# EAGLE design gpib-usbcdc (EAGLE 4.16)
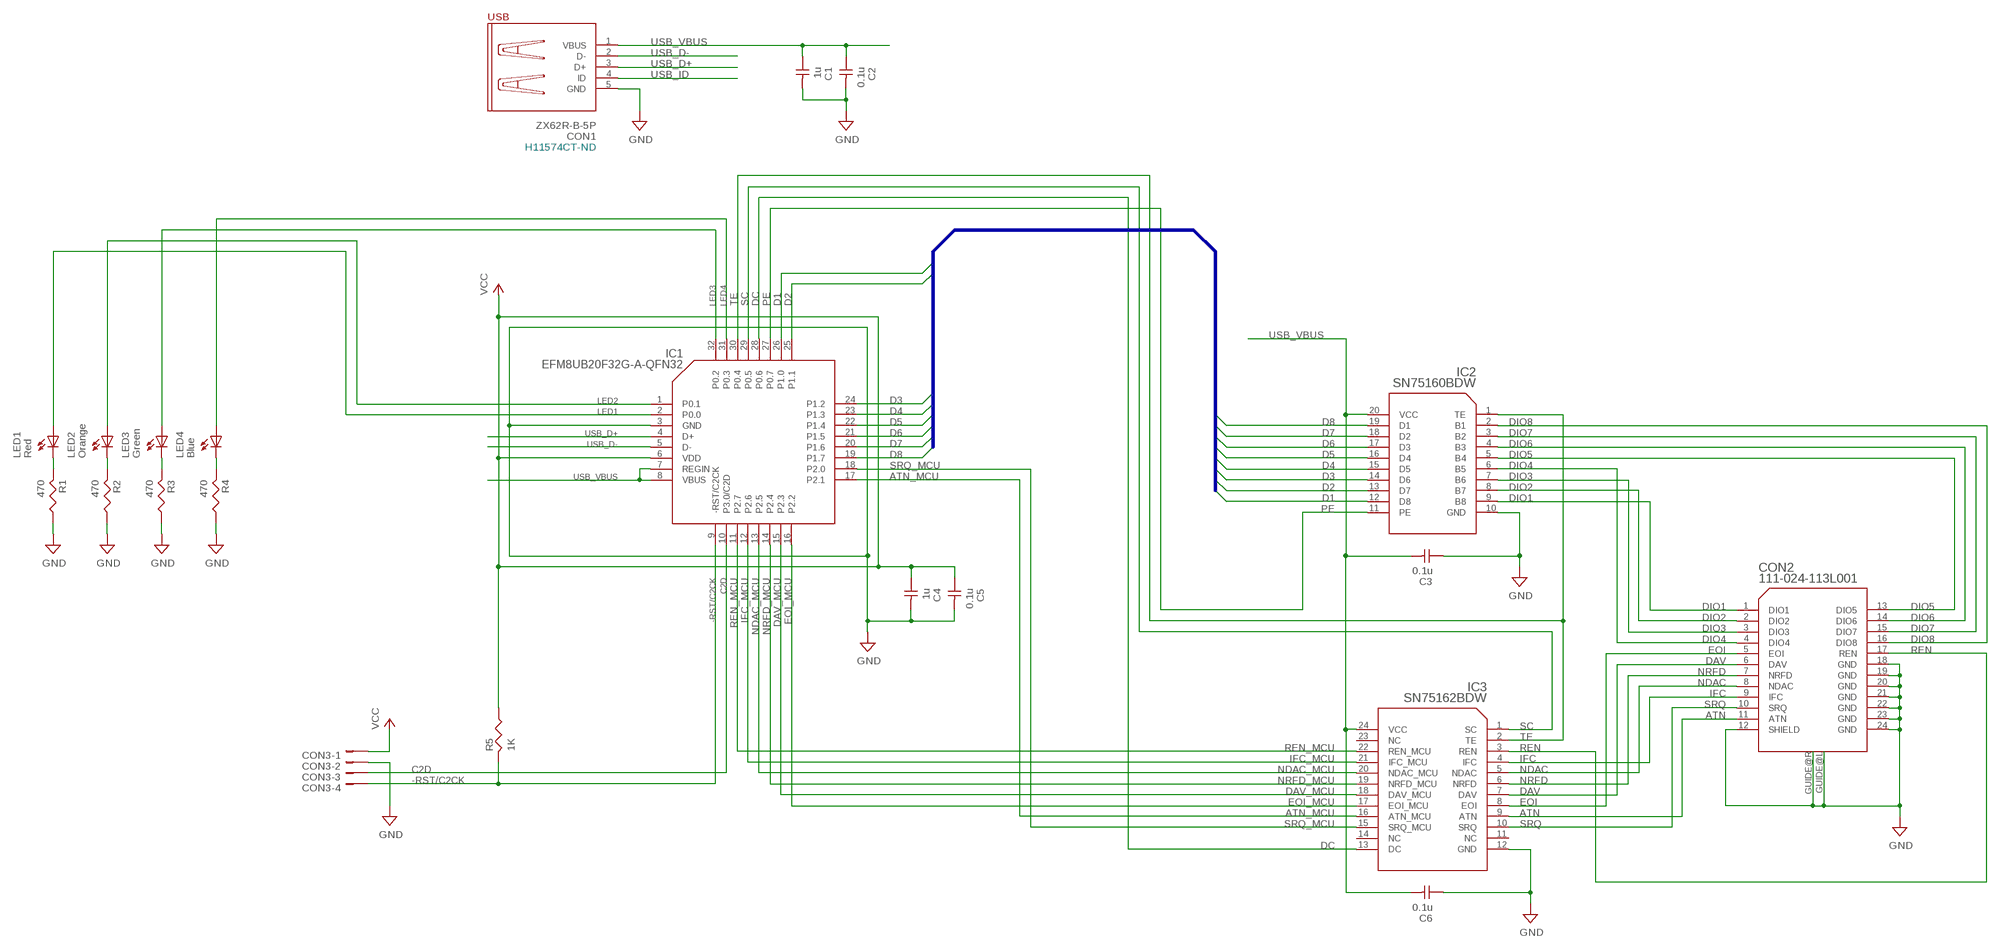
[diagram p0: schematic, sheet 1]

## Parts
C1  1u  C1005  [1005]
C2  0.1u  C1005  [1005]
C3  0.1u  C1005  [1005]
C4  1u  C1005  [1005]
C5  0.1u  C1005  [1005]
C6  0.1u  C1005  [1005]
CON1  ZX62R-B-5P  ZX62-AB-5PA-R-2PAD  [ZX62R-AB-5PA(-2PAD)]
CON2  111-024-113L001  [111-024-113L001]
CON3  JST_ZH-4B  [JST_ZH-4B]
IC1  EFM8UB20F32G-A-QFN32  C8051F341_32-GM  [QFN32]
IC2  SN75160BDW  SN75ALS160DW  [SO20]
IC3  SN75162BDW  SN75ALS162DW  [SO24]
LED1  Red  LED1608  [1608D]
LED2  Orange  LED1608  [1608D]
LED3  Green  LED1608  [1608D]
LED4  Blue  LED1608  [1608D]
R1  470  R1005  [1005]
R2  470  R1005  [1005]
R3  470  R1005  [1005]
R4  470  R1005  [1005]
R5  1K  R1005  [1005]

## Nets
-RST/C2CK: CON3.4 IC1.9(-RST/C2CK) R5.P$2
ATN: CON2.11(ATN) IC3.9(ATN)
ATN_MCU: IC1.17(P2.1) IC3.16(ATN_MCU)
C2D: CON3.3 IC1.10(P3.0/C2D)
D1: IC1.26(P1.0) IC2.12(D8)
D2: IC1.25(P1.1) IC2.13(D7)
D3: IC1.24(P1.2) IC2.14(D6)
D4: IC1.23(P1.3) IC2.15(D5)
D5: IC1.22(P1.4) IC2.16(D4)
D6: IC1.21(P1.5) IC2.17(D3)
D7: IC1.20(P1.6) IC2.18(D2)
D8: IC1.19(P1.7) IC2.19(D1)
DAV: CON2.6(DAV) IC3.7(DAV)
DAV_MCU: IC1.15(P2.3) IC3.18(DAV_MCU)
DC: IC1.28(P0.6) IC3.13(DC)
DIO1: CON2.1(DIO1) IC2.9(B8)
DIO2: CON2.2(DIO2) IC2.8(B7)
DIO3: CON2.3(DIO3) IC2.7(B6)
DIO4: CON2.4(DIO4) IC2.6(B5)
DIO5: CON2.13(DIO5) IC2.5(B4)
DIO6: CON2.14(DIO6) IC2.4(B3)
DIO7: CON2.15(DIO7) IC2.3(B2)
DIO8: CON2.16(DIO8) IC2.2(B1)
EOI: CON2.5(EOI) IC3.8(EOI)
EOI_MCU: IC1.16(P2.2) IC3.17(EOI_MCU)
GND: C1.P$2 C2.P$2 C3.P$1 C4.P$2 C5.P$2 C6.P$1 CON1.5(GND) CON2.12(SHIELD) CON2.18(GND) CON2.19(GND) CON2.20(GND) CON2.21(GND) CON2.22(GND) CON2.23(GND) CON2.24(GND) CON2.GUIDE@L CON2.GUIDE@R CON3.2 IC1.3(GND) IC2.10(GND) IC3.12(GND) R1.P$1 R2.P$1 R3.P$1 R4.P$1
IFC: CON2.9(IFC) IC3.4(IFC)
IFC_MCU: IC1.12(P2.6) IC3.21(IFC_MCU)
LED1: IC1.2(P0.0) LED1.A
LED2: IC1.1(P0.1) LED2.A
LED3: IC1.32(P0.2) LED3.A
LED4: IC1.31(P0.3) LED4.A
N$1: LED1.K R1.P$2
N$2: LED3.K R3.P$2
N$6: LED2.K R2.P$2
N$20: LED4.K R4.P$2
NDAC: CON2.8(NDAC) IC3.5(NDAC)
NDAC_MCU: IC1.13(P2.5) IC3.20(NDAC_MCU)
NRFD: CON2.7(NRFD) IC3.6(NRFD)
NRFD_MCU: IC1.14(P2.4) IC3.19(NRFD_MCU)
PE: IC1.27(P0.7) IC2.11(PE)
REN: CON2.17(REN) IC3.3(REN)
REN_MCU: IC1.11(P2.7) IC3.22(REN_MCU)
SC: IC1.29(P0.5) IC3.1(SC)
SRQ: CON2.10(SRQ) IC3.10(SRQ)
SRQ_MCU: IC1.18(P2.0) IC3.15(SRQ_MCU)
TE: IC1.30(P0.4) IC2.1(TE) IC3.2(TE)
USB_D+: CON1.3(D+) IC1.4(D+)
USB_D-: CON1.2(D-) IC1.5(D-)
USB_ID: CON1.4(ID)
USB_VBUS: C1.P$1 C2.P$1 C3.P$2 C6.P$2 CON1.1(VBUS) IC1.7(REGIN) IC1.8(VBUS) IC2.20(VCC) IC3.24(VCC)
VCC: C4.P$1 C5.P$1 CON3.1 IC1.6(VDD) R5.P$1
Unconnected: IC3.11(NC) IC3.14(NC) IC3.23(NC)

## Buses
D[1..8]

## Notes on the sheet
- H11574CT-ND

## Power pins joined to a net without a drawn wire
GND: CON1.GUIDE@L1(GND) CON1.GUIDE@L3(GND) CON1.GUIDE@R1(GND) CON1.GUIDE@R3(GND)

## Library data of the parts
C1-C6 = additional:C: Capacitor (Non-Polar)
CON1 = additional:ZX62-AB-5PA: USB Micro-AB Connector
CON2 = gpib:111-024-113L001: NorComp 111-024-113L001 24pin connector for GPIB
CON3 = additional:JST_ZH-4*: JST_ZH-4 1.5mm pitch 4-pins Connector.
IC1 = main:C8051F34*_32: C8051F342/3/6/7 C8051F381/3/5/7 Full Speed USB Flash MCU 32 pins
IC2 = gpib:SN75ALS160: SN75ALS160 Octal general-purpose interface bus transceiver
IC3 = gpib:SN75ALS162: SN75ALS162 OCTAL GENERAL-PURPOSE INTERFACE BUS TRANSCEIVER
LED1-LED4 = additional:LED: Light Emitting Diode
R1-R5 = additional:R: Resistance

## Board
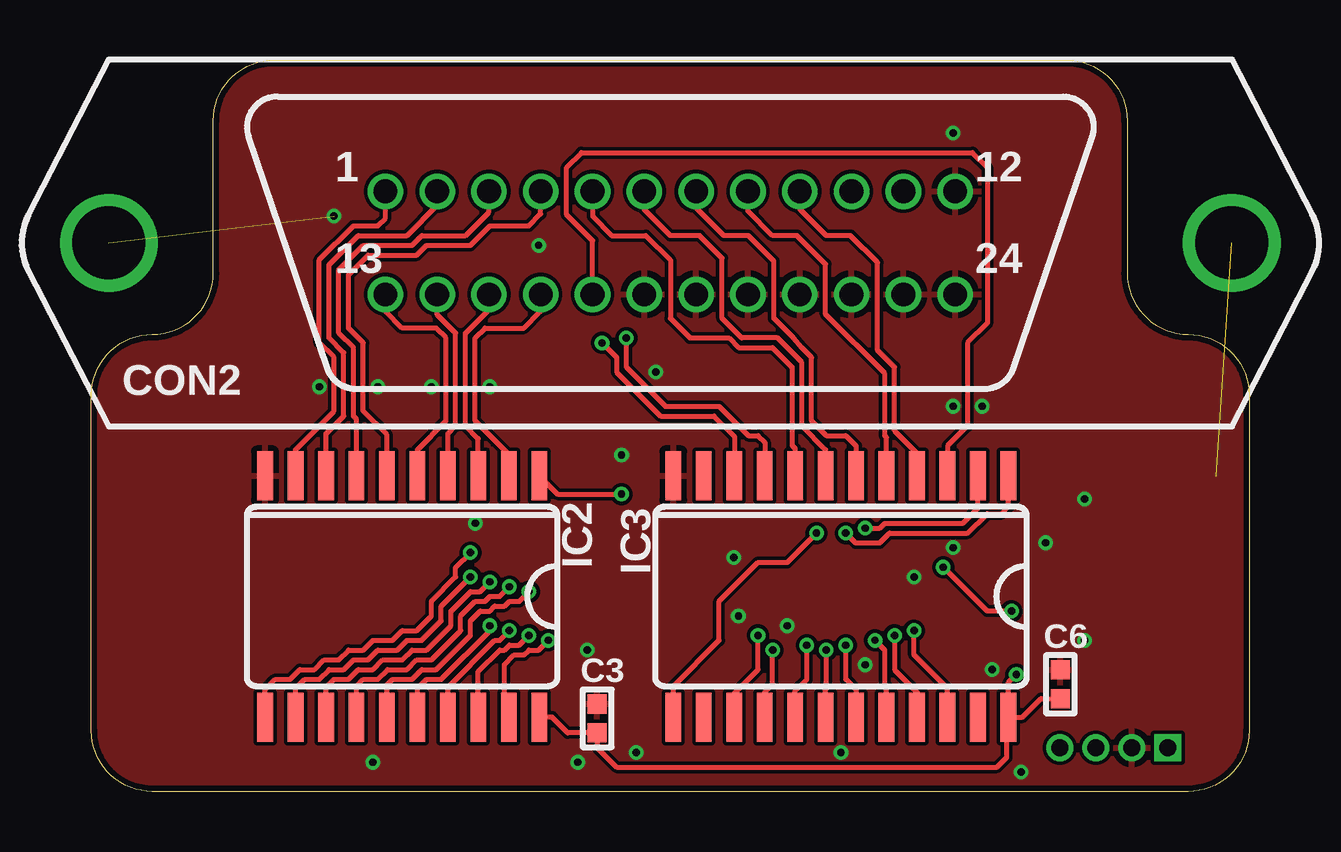
[diagram p1: board, top side]
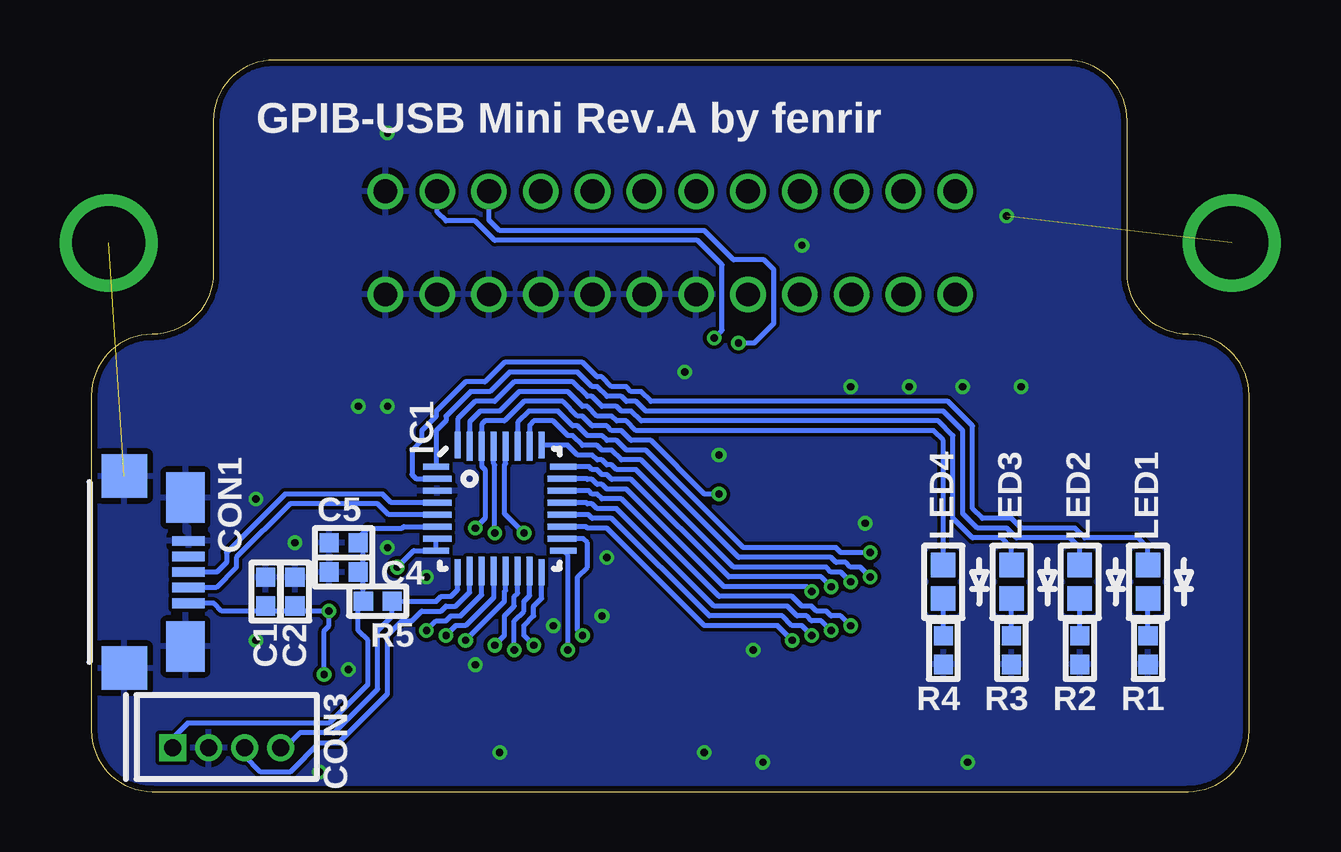
[diagram p2: board, bottom side, seen from below]

Size 48.26 x 30.48 mm. Coordinates in mm from the lower left corner, seen from the top.
Outline: 5.08,27.94 arc-90 7.62,30.48 40.64,30.48 arc-90 43.18,27.94 43.18,21.59 arc90 45.72,19.05 arc-90 48.26,16.51 48.26,2.54 arc-90 45.72,0 2.54,0 arc-90 0,2.54 0,16.51 arc-90 2.54,19.05 arc90 5.08,21.59 5.08,27.94
Copper layers (1*2*15*16): Top 0.035mm / dielectric 0.2mm / Route2 0.0175mm / dielectric 1.1mm / Route15 0.0175mm / dielectric 0.2mm / Bottom 0.035mm
Design rules "SeeedStudio_DRU_no_angle_20130527": minimum track width 6mil, minimum drill 12mil, track to track 6mil, track to pad 6mil, pad to pad 6mil, via to via 6mil, smd to smd 0mil, copper to edge 10mil, drill to drill 10mil, minimum pad ring 6mil, minimum via ring 6mil, stop-mask expansion 2mil, vias tented up to drill 25mil, thermal gap 10mil

### Footprints (pad centres in the part's own frame; a part is rotated, then mirrored left to right if it is on the bottom)
1005 = smd 0.8 x 0.8: P$1 -0.6,0; P$2 0.6,0
ZX62R-AB-5PA(-2PAD) = smd 0.4 x 1.35: 1 1.3,2.675; 2 0.65,2.675; 3 0,2.675; 4 -0.65,2.675; 5 -1.3,2.675 | smd 2.1 x 1.6: GUIDE@L1 -3.1,2.55; GUIDE@R1 3.1,2.55 | smd 1.8 x 1.9: GUIDE@L3 -4,0; GUIDE@R3 4,0
111-024-113L001 = drill 0.991 round: 1 -11.874,2.146; 2 -9.716,2.146; 3 -7.556,2.146; 4 -5.397,2.146; 5 -3.239,2.146; 6 -1.079,2.146; 7 1.079,2.146; 8 3.239,2.146; 9 5.397,2.146; 10 7.556,2.146; 11 9.716,2.146; 12 11.874,2.146; 13 -11.874,-2.146; 14 -9.716,-2.146; 15 -7.556,-2.146; 16 -5.397,-2.146; 17 -3.239,-2.146; 18 -1.079,-2.146; 19 1.079,-2.146; 20 3.239,-2.146; 21 5.397,-2.146; 22 7.556,-2.146; 23 9.716,-2.146; 24 11.874,-2.146 | drill 3.048 round: GUIDE@L -23.406,0; GUIDE@R 23.406,0
JST_ZH-4B = drill 0.711 pad 1.118 square: 1 -2.25,0 | drill 0.711 pad 1.118 round: 2 -0.75,0; 3 0.75,0; 4 2.25,0
QFN32 = smd 1.1 x 0.25: 1 -2.65,1.75; 8 -2.65,-1.75; 17 2.65,-1.75; 24 2.65,1.75 | smd 1.2 x 0.25: 2 -2.6,1.25; 3 -2.6,0.75; 4 -2.6,0.25; 5 -2.6,-0.25; 6 -2.6,-0.75; 7 -2.6,-1.25; 18 2.6,-1.25; 19 2.6,-0.75; 20 2.6,-0.25; 21 2.6,0.25; 22 2.6,0.75; 23 2.6,1.25 | smd 0.25 x 1.1: 9 -1.75,-2.65; 16 1.75,-2.65; 25 1.75,2.65; 32 -1.75,2.65 | smd 0.25 x 1.2: 10 -1.25,-2.6; 11 -0.75,-2.6; 12 -0.25,-2.6; 13 0.25,-2.6; 14 0.75,-2.6; 15 1.25,-2.6; 26 1.25,2.6; 27 0.75,2.6; 28 0.25,2.6; 29 -0.25,2.6; 30 -0.75,2.6; 31 -1.25,2.6
SO20 = smd 0.66 x 2.032: 1 -5.715,-5.029; 2 -4.445,-5.029; 3 -3.175,-5.029; 4 -1.905,-5.029; 5 -0.635,-5.029; 6 0.635,-5.029; 7 1.905,-5.029; 8 3.175,-5.029; 9 4.445,-5.029; 10 5.715,-5.029; 11 5.715,5.029; 12 4.445,5.029; 13 3.175,5.029; 14 1.905,5.029; 15 0.635,5.029; 16 -0.635,5.029; 17 -1.905,5.029; 18 -3.175,5.029; 19 -4.445,5.029; 20 -5.715,5.029
SO24 = smd 0.66 x 2.032: 1 -6.985,-5.029; 2 -5.715,-5.029; 3 -4.445,-5.029; 4 -3.175,-5.029; 5 -1.905,-5.029; 6 -0.635,-5.029; 7 0.635,-5.029; 8 1.905,-5.029; 9 3.175,-5.029; 10 4.445,-5.029; 11 5.715,-5.029; 12 6.985,-5.029; 13 6.985,5.029; 14 5.715,5.029; 15 4.445,5.029; 16 3.175,5.029; 17 1.905,5.029; 18 0.635,5.029; 19 -0.635,5.029; 20 -1.905,5.029; 21 -3.175,5.029; 22 -4.445,5.029; 23 -5.715,5.029; 24 -6.985,5.029
1608D = smd 1.016 x 1.016: A -0.7,0; K 0.7,0

### Placement (x,y rotation side)
C1  41,8.33 90 bottom
C2  39.78,8.33 90 bottom
C3  21.08,3.05 270 top
C4  37.74,9.14 180 bottom
C5  37.74,10.36 180 bottom
C6  40.39,4.47 270 top
CON1  46.89,9.14 270 bottom
CON2  24.13,22.86 0 top
CON3  42.62,1.83 0 bottom
IC1  31.24,11.79 0 bottom
IC2  12.95,8.13 180 top
IC3  31.24,8.13 180 top
LED1  4.22,8.74 270 bottom
LED2  7.06,8.74 270 bottom
LED3  9.91,8.74 270 bottom
LED4  12.75,8.74 270 bottom
R1  4.22,5.89 90 bottom
R2  7.06,5.89 90 bottom
R3  9.91,5.89 90 bottom
R4  12.75,5.89 90 bottom
R5  36.32,7.92 0 bottom

### Tracks (layer width: path | path; a pad name or v marks a point on that pad's centre or on a via)
-RST/C2CK
  Bottom 0.203: IC1.9 32.99,8.41 33.27,8.13 33.68,8.13 33.88,7.92 R5.P$2 35.72,7.31 36.32,6.71 36.32,4.27 38.15,2.44 39.57,2.44 40.18,1.83 CON3.4
ATN  (via drill 0.3)
  Top 0.203: IC3.9 28.07,14.55 27.79,14.83 27.38,14.83 26.16,16.05 23.93,16.05 22.3,17.68 v22.3,18.9
  Bottom 0.203: CON2.11 33.85,24.14 33.48,23.77 32.26,23.77 31.45,22.96 22.99,22.96 21.97,21.95 21.97,19.23 v22.3,18.9
ATN_MCU  (via drill 0.3)
  Top 0.203: IC3.16 28.07,4.14 28.4,4.47 v28.4,5.89
  Bottom 0.203: IC1.17 28.4,9.84 v28.4,5.89
C2D
  Bottom 0.203: IC1.10 32.49,8.3 33.07,7.72 33.48,7.72 33.68,7.52 34.49,7.52 34.9,7.11 35.31,7.11 35.92,6.5 35.92,4.06 37.95,2.03 38.76,2.03 39.98,0.81 41.2,0.81 41.87,1.49 CON3.3
D1  (via drill 0.3)
  Top 0.203: IC2.12 8.51,4.29 8.89,4.67 9.5,4.67 9.91,5.08 10.52,5.08 10.92,5.49 11.53,5.49 11.94,5.89 12.75,5.89 13.16,6.3 13.77,6.3 14.58,7.11 14.58,7.72 v15.8,8.94
  Bottom 0.203: IC1.26 29.99,15.27 29.82,15.44 29.01,15.44 28.4,14.83 28.19,14.83 27.79,14.43 27.18,14.43 26.98,14.22 26.57,14.22 26.16,13.82 25.35,13.82 21.29,9.75 17.42,9.75 17.22,9.55 16.81,9.55 16.61,9.35 16.2,9.35 v15.8,8.94
D2  (via drill 0.3)
  Top 0.203: v16.61,8.74 16.2,8.33 15.8,8.33 14.99,7.52 14.99,6.91 13.97,5.89 13.36,5.89 12.95,5.49 12.14,5.49 11.74,5.08 11.13,5.08 10.72,4.67 10.11,4.67 9.78,4.34 IC2.13
  Bottom 0.203: IC1.25 28.41,14.44 27.99,14.02 27.38,14.02 27.18,13.82 26.98,13.82 26.77,13.61 26.57,13.61 26.37,13.41 25.55,13.41 21.49,9.35 17.63,9.35 17.42,9.14 17.02,9.14 v16.61,8.74
D3  (via drill 0.3)
  Top 0.203: v17.42,8.53 17.02,8.13 16.61,8.13 16.41,7.92 16,7.92 15.39,7.32 15.39,6.71 14.17,5.49 13.56,5.49 13.16,5.08 12.34,5.08 11.94,4.67 11.33,4.67 11.05,4.39 IC2.14
  Bottom 0.203: IC1.24 27.51,13.54 27.38,13.41 27.18,13.41 26.98,13.21 26.77,13.21 26.57,13.01 25.76,13.01 21.69,8.94 17.83,8.94 v17.42,8.53
D4  (via drill 0.3)
  Top 0.203: IC2.15 12.32,4.45 12.55,4.67 13.36,4.67 13.77,5.08 14.38,5.08 15.8,6.5 15.8,7.11 16.2,7.52 16.61,7.52 16.81,7.72 17.22,7.72 17.42,7.92 17.83,7.92 v18.24,8.33
  Bottom 0.203: IC1.23 27.62,13.04 27.58,13.01 27.38,13.01 27.18,12.8 26.98,12.8 26.77,12.6 25.96,12.6 21.9,8.53 18.44,8.53 v18.24,8.33
D5  (via drill 0.3)
  Top 0.203: v16.61,6.91 16.61,6.71 14.58,4.67 13.97,4.67 13.59,4.29 IC2.16
  Bottom 0.203: IC1.22 27.52,12.54 27.38,12.39 27.18,12.39 26.98,12.19 26.16,12.19 22.1,8.13 19.05,8.13 18.64,7.72 18.24,7.72 18.03,7.52 17.63,7.52 17.42,7.32 17.02,7.32 v16.61,6.91
D6  (via drill 0.3)
  Top 0.203: v17.42,6.71 17.02,6.3 16.81,6.3 14.86,4.34 IC2.17
  Bottom 0.203: IC1.21 27.63,12.04 27.58,11.99 27.38,11.99 27.18,11.79 26.37,11.79 22.3,7.72 19.25,7.72 18.85,7.32 18.44,7.32 18.24,7.11 17.83,7.11 v17.42,6.71
D7  (via drill 0.3)
  Top 0.203: v18.24,6.5 17.83,6.1 17.42,6.1 17.22,5.89 17.02,5.89 16.13,5 IC2.18
  Bottom 0.203: IC1.20 27.54,11.54 27.38,11.38 26.57,11.38 22.5,7.32 19.46,7.32 19.05,6.91 18.64,6.91 v18.24,6.5
D8  (via drill 0.3)
  Top 0.203: v19.05,6.3 18.64,5.89 18.24,5.89 18.03,5.69 17.63,5.69 17.22,5.28 17.22,3.28 IC2.19
  Bottom 0.203: IC1.19 27.65,11.04 27.58,10.97 26.77,10.97 22.71,6.91 19.66,6.91 v19.05,6.3
DAV
  Top 0.203: CON2.6 23.05,24.24 24.13,23.16 25.35,23.16 26.29,22.23 26.29,19.71 27.1,18.9 28.6,18.9 29.62,17.88 29.62,15.24 30.61,14.25 IC3.7
DAV_MCU  (via drill 0.3)
  Top 0.203: IC3.18 30.61,4.24 30.63,4.27 v30.63,5.89
  Bottom 0.203: IC1.15 29.99,8.16 30.23,7.92 30.23,7.52 30.63,7.11 v30.63,5.89
DC  (via drill 0.3)
  Top 0.203: IC3.13 24.26,4.39 26.16,6.3 26.16,7.92 27.79,9.55 29.01,9.55 v30.23,10.77
  Bottom 0.203: IC1.28 30.99,13.66 31.04,13.61 31.04,11.58 v30.23,10.77
DIO1
  Top 0.203: CON2.1 12.26,23.89 11.94,23.57 10.92,23.57 9.5,22.15 9.5,18.69 10.11,18.09 10.11,15.85 8.51,14.25 IC2.9
DIO2
  Top 0.203: CON2.2 14.42,24.42 13.16,23.16 11.13,23.16 9.91,21.95 9.91,18.9 10.52,18.29 10.52,15.65 9.78,14.91 IC2.8
DIO3
  Top 0.203: CON2.3 16.57,24.14 15.6,23.16 13.77,23.16 13.36,22.76 11.33,22.76 10.31,21.74 10.31,19.1 10.92,18.49 10.92,15.65 11.05,15.52 IC2.7
DIO4
  Top 0.203: CON2.4 18.73,24.07 18.24,23.57 16.61,23.57 15.8,22.76 13.97,22.76 13.56,22.35 11.53,22.35 10.72,21.54 10.72,19.3 11.33,18.69 11.33,15.85 12.32,14.86 IC2.6
DIO5
  Top 0.203: IC2.5 13.59,14.25 14.78,15.44 14.78,18.9 14.38,19.3 12.95,19.3 12.26,20 CON2.13
DIO6
  Top 0.203: IC2.4 14.86,14.91 15.19,15.24 15.19,19.1 14.42,19.88 CON2.14
DIO7
  Top 0.203: IC2.3 16.13,14.71 15.6,15.24 15.6,19.1 16.57,20.08 CON2.15
DIO8
  Top 0.203: IC2.2 17.4,14.05 16,15.44 16,18.9 16.41,19.3 18.03,19.3 18.73,20 CON2.16
EOI
  Top 0.203: CON2.5 20.89,23.96 21.69,23.16 23.11,23.16 24.13,22.15 24.13,19.71 24.94,18.9 26.57,18.9 26.98,18.49 28.4,18.49 29.21,17.68 29.21,14.43 29.34,14.3 IC3.8
EOI_MCU  (via drill 0.3)
  Top 0.203: IC3.17 29.34,4.19 29.82,4.67 v29.82,6.1
  Bottom 0.203: IC1.16 29.49,8.05 29.82,7.72 29.82,7.32 30.23,6.91 30.23,6.5 v29.82,6.1
GND  (via drill 0.3)  (2 unrouted)
  other vias: 16,11.18 22.1,14.02 16.61,16.87 23.52,17.48 14.17,16.87 9.5,16.87 20.68,5.89 26.77,9.75 26.97,7.32 34.29,8.94 35.92,10.16 41.4,6.3 39.78,10.36 41.4,12.19 35.92,16.05 37.13,16.05 11.73,1.22 22.71,1.63 20.27,1.22 38.76,0.81 37.54,5.08 29.01,6.91 32.26,5.28 31.24,1.63 11.94,16.87 10.11,23.98 18.64,22.76 35.92,27.43
  pour Top: 5.08,30.48 5.08,21.59 arc-90 2.54,19.05 arc90 0,16.51 0,0 48.26,0 48.26,16.51 arc90 45.72,19.05 arc-90 43.18,21.59 43.18,30.48
  pour Bottom: 5.08,30.48 5.08,21.59 arc-90 2.54,19.05 arc90 0,16.51 0,0 48.26,0 48.26,16.51 arc90 45.72,19.05 arc-90 43.18,21.59 43.18,30.48
IFC
  Top 0.203: CON2.9 29.53,24.27 30.63,23.16 31.65,23.16 32.77,22.05 32.77,18.39 33.48,17.68 33.48,15.04 34.42,14.1 IC3.4
IFC_MCU  (via drill 0.3)
  Top 0.203: IC3.21 34.42,4.14 33.48,5.08 v33.48,6.5
  Bottom 0.203: IC1.12 31.49,8.08 32.66,6.91 33.07,6.91 v33.48,6.5
LED1
  Bottom 0.203: IC1.2 34.73,13.04 34.9,13.21 34.9,14.22 34.49,14.63 34.49,15.04 33.88,15.65 33.88,15.85 32.66,17.07 31.85,17.07 31.04,17.88 27.79,17.88 27.18,17.27 26.98,17.27 26.57,16.87 25.96,16.87 25.76,16.66 25.35,16.66 24.94,16.26 12.55,16.26 11.53,15.24 11.53,11.79 11.13,11.38 9.91,11.38 9.5,10.97 7.26,10.97 6.86,10.57 4.62,10.57 4.22,10.16 LED1.A
LED2
  Bottom 0.203: IC1.1 33.89,15.03 33.48,15.44 33.48,15.65 32.46,16.66 31.65,16.66 30.84,17.48 27.99,17.48 27.38,16.87 27.18,16.87 26.77,16.46 26.16,16.46 25.96,16.26 25.55,16.26 25.15,15.85 12.75,15.85 11.94,15.04 11.94,11.58 11.33,10.97 10.11,10.97 9.7,10.57 7.47,10.57 7.06,10.16 LED2.A
LED3
  Bottom 0.203: IC1.32 32.99,15.52 32.26,16.26 31.45,16.26 30.63,17.07 28.19,17.07 27.58,16.46 27.38,16.46 26.98,16.05 26.37,16.05 26.16,15.85 25.76,15.85 25.35,15.44 12.95,15.44 12.34,14.83 12.34,11.38 11.53,10.57 10.31,10.57 9.91,10.16 LED3.A
LED4
  Bottom 0.203: IC1.31 32.49,15.41 32.05,15.85 31.24,15.85 30.43,16.66 28.4,16.66 27.79,16.05 27.58,16.05 27.18,15.65 26.57,15.65 26.37,15.44 25.96,15.44 25.55,15.04 13.16,15.04 12.75,14.63 LED4.A
N$1
  Bottom 0.203: R1.P$2 LED1.K
N$2
  Bottom 0.203: R3.P$2 LED3.K
N$6
  Bottom 0.203: R2.P$2 LED2.K
N$20
  Bottom 0.203: R4.P$2 LED4.K
NDAC
  Top 0.203: CON2.8 27.37,24.19 28.4,23.16 29.41,23.16 30.61,21.97 30.61,19.89 33.07,17.42 33.07,14.83 33.15,14.76 IC3.5
NDAC_MCU  (via drill 0.3)
  Top 0.203: IC3.20 33.15,4.39 33.07,4.47 33.07,5.89 v32.66,6.3
  Bottom 0.203: IC1.13 30.99,8.38 31.04,8.33 31.04,7.92 v32.66,6.3
NRFD
  Top 0.203: CON2.7 25.21,24.32 26.37,23.16 27.38,23.16 28.45,22.1 28.45,19.71 29.26,18.9 29.62,18.49 30.02,18.09 30.02,15.44 30.63,14.83 31.45,14.83 31.88,14.4 IC3.6
NRFD_MCU  (via drill 0.3)
  Top 0.203: IC3.19 31.88,4.24 31.45,4.67 v31.45,6.1
  Bottom 0.203: IC1.14 30.49,8.27 30.63,8.13 30.63,7.72 31.04,7.32 31.04,6.5 v31.45,6.1
PE  (via drill 0.3)
  Top 0.203: IC2.11 7.24,4.24 7.67,4.67 8.28,4.67 8.69,5.08 9.3,5.08 9.7,5.49 10.31,5.49 10.72,5.89 11.33,5.89 11.74,6.3 12.55,6.3 12.95,6.71 13.56,6.71 14.17,7.32 14.17,7.92 15.19,8.94 15.19,9.35 v15.8,9.96
  Bottom 0.203: IC1.27 30.49,15.38 30.02,15.85 28.8,15.85 28.19,15.24 27.99,15.24 27.58,14.83 26.98,14.83 26.77,14.63 26.37,14.63 25.96,14.22 25.15,14.22 21.08,10.16 17.22,10.16 17.02,9.96 v15.8,9.96
REN
  Top 0.203: CON2.17 20.89,22.95 19.81,24.03 19.81,26.01 20.42,26.62 36.73,26.62 37.34,26.01 37.34,19.51 36.52,18.69 36.52,15.24 35.69,14.4 IC3.3
REN_MCU  (via drill 0.3)
  Top 0.203: IC3.22 35.69,4.29 34.29,5.69 v34.29,6.71
  Bottom 0.203: IC1.11 31.99,8.19 32.87,7.32 33.27,7.32 33.48,7.11 33.88,7.11 v34.29,6.71
SC  (via drill 0.3)
  Top 0.203: v31.45,10.77 31.85,10.36 32.87,10.36 33.27,10.77 36.52,10.77 37.34,11.58 37.95,11.58 38.23,11.86 IC3.1
  Bottom 0.203: IC1.29 31.49,13.66 31.45,13.61 v31.45,10.77
SRQ  (via drill 0.3)
  Top 0.203: IC3.10 26.8,14.81 25.96,15.65 23.72,15.65 21.9,17.48 21.9,18.09 v21.29,18.69
  Bottom 0.203: CON2.10 31.69,23.81 31.24,23.37 22.71,23.37 21.49,22.15 20.22,22.15 19.81,21.74 19.81,19.51 20.62,18.69 v21.29,18.69
SRQ_MCU  (via drill 0.3)
  Top 0.203: v27.79,6.5 27.79,5.08 26.8,4.09 IC3.15
  Bottom 0.203: IC1.18 27.76,10.54 27.58,10.36 27.58,9.35 27.99,8.94 27.99,6.71 v27.79,6.5
TE  (via drill 0.3)
  Top 0.203: IC3.2 36.96,11.81 36.32,11.18 33.07,11.18 32.87,10.97 v32.26,10.97 | IC2.1 19.43,12.39 v22.1,12.39
  Bottom 0.203: v32.26,10.97 31.85,11.38 31.85,13.41 31.99,13.55 IC1.30 31.99,15.3 31.85,15.44 31.04,15.44 30.23,16.26 28.6,16.26 27.99,15.65 27.79,15.65 27.38,15.24 26.77,15.24 26.57,15.04 26.16,15.04 25.76,14.63 24.94,14.63 22.71,12.39 v22.1,12.39
USB_D+
  Bottom 0.203: IC1.4 35.76,12.04 36.12,12.39 40.18,12.39 42.62,9.96 42.62,9.55 43.03,9.14 CON1.3
USB_D-
  Bottom 0.203: IC1.5 35.87,11.54 36.32,11.99 39.98,11.99 42.21,9.75 42.21,9.35 43.07,8.49 CON1.2
USB_VBUS  (via drill 0.3)
  Top 0.203: v38.35,7.52 37.34,7.52 v35.51,9.35 | IC2.20 19.2,3.1 19.85,2.45 C3.P$2 21.08,1.83 21.9,1.02 37.74,1.02 38.15,1.42 38.15,2.44 38.23,2.52 IC3.24 | IC3.24 38.23,4.55 v38.56,4.88 | IC3.24 38.81,3.1 39.58,3.87 C6.P$2
  Bottom 0.203: CON1.1 43.15,7.84 42.82,7.52 41.21,7.52 C1.P$1 40.78,7.52 39.99,7.52 C2.P$1 39.56,7.52 v38.35,7.52 38.35,6.91 38.56,6.71 v38.56,4.88 | IC1.7 33.88,10.49 IC1.8 34.82,10.04 v35.51,9.35
VCC
  Bottom 0.203: IC1.6 35.24,11.04 35.31,10.97 36.73,10.97 37.14,10.56 C5.P$1 36.93,10.15 36.93,9.36 C4.P$1 36.93,8.93 36.93,7.93 R5.P$1 37.13,7.71 37.13,6.71 36.73,6.3 36.73,4.47 38.35,2.85 44.25,2.85 44.87,2.22 CON3.1

### Text on the board
bPlace: GPIB-USB Mini Rev.A by fenrir